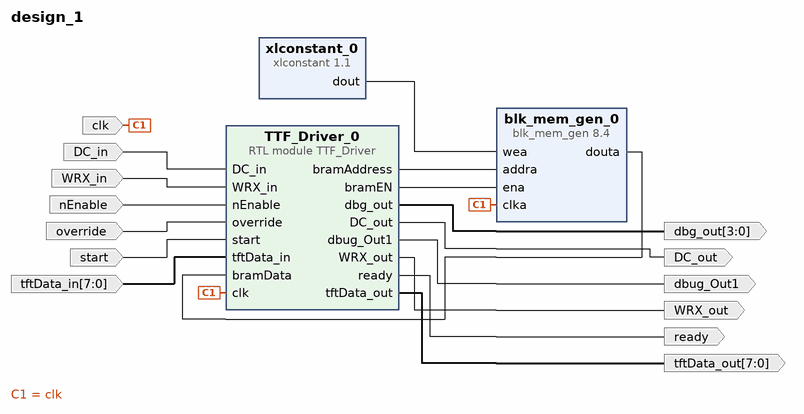
[diagram p0: block diagram of the top level]
# Vivado block design design_1, xc7a35tcpg236-1, Vivado 2023.2
create_bd_design design_1

create_bd_port -dir O DC_out
create_bd_port -dir O dbug_Out1
create_bd_port -dir I start
create_bd_port -dir O ready
create_bd_port -dir I nEnable
create_bd_port -dir I -type clk clk
create_bd_port -dir O -from 7 -to 0 tftData_out
create_bd_port -dir I WRX_in
create_bd_port -dir I DC_in
create_bd_port -dir I override
create_bd_port -dir O -from 3 -to 0 dbg_out
create_bd_port -dir O WRX_out
create_bd_port -dir I -from 7 -to 0 tftData_in

create_bd_cell -type ip -vlnv xilinx.com:ip:blk_mem_gen:8.4 blk_mem_gen_0
set_property -dict [list \
  CONFIG.Coe_File ../../../../../../../MemoryMap8Pix.coe \
  CONFIG.Enable_32bit_Address true \
  CONFIG.Load_Init_File true \
  CONFIG.Memory_Type Single_Port_RAM \
  CONFIG.Register_PortA_Output_of_Memory_Primitives true \
  CONFIG.Use_RSTA_Pin false \
  CONFIG.use_bram_block Stand_Alone \
] [get_bd_cells blk_mem_gen_0]
create_bd_cell -type ip -vlnv xilinx.com:ip:xlconstant:1.1 xlconstant_0
set_property -dict {CONFIG.CONST_VAL 0 CONFIG.CONST_WIDTH 4} [get_bd_cells xlconstant_0]
create_bd_cell -type module -reference TTF_Driver TTF_Driver_0

# ---- connections ----

connect_bd_net -net DC_in_0_1 [get_bd_ports DC_in] [get_bd_pins TTF_Driver_0/DC_in]
connect_bd_net [get_bd_pins TTF_Driver_0/DC_out] [get_bd_ports DC_out]
connect_bd_net [get_bd_pins TTF_Driver_0/WRX_out] [get_bd_ports WRX_out]
connect_bd_net [get_bd_pins TTF_Driver_0/bramAddress] [get_bd_pins blk_mem_gen_0/addra]
connect_bd_net [get_bd_pins TTF_Driver_0/bramEN] [get_bd_pins blk_mem_gen_0/ena]
connect_bd_net [get_bd_pins TTF_Driver_0/dbg_out] [get_bd_ports dbg_out]
connect_bd_net [get_bd_pins TTF_Driver_0/dbug_Out1] [get_bd_ports dbug_Out1]
connect_bd_net [get_bd_pins TTF_Driver_0/ready] [get_bd_ports ready]
connect_bd_net [get_bd_pins TTF_Driver_0/tftData_out] [get_bd_ports tftData_out]
connect_bd_net -net WRX_in_0_1 [get_bd_ports WRX_in] [get_bd_pins TTF_Driver_0/WRX_in]
connect_bd_net [get_bd_pins blk_mem_gen_0/douta] [get_bd_pins TTF_Driver_0/bramData]
connect_bd_net -net clk_0_1 [get_bd_ports clk] [get_bd_pins blk_mem_gen_0/clka] [get_bd_pins TTF_Driver_0/clk]
connect_bd_net -net nEnable_0_1 [get_bd_ports nEnable] [get_bd_pins TTF_Driver_0/nEnable]
connect_bd_net -net override_0_1 [get_bd_ports override] [get_bd_pins TTF_Driver_0/override]
connect_bd_net -net start_0_1 [get_bd_ports start] [get_bd_pins TTF_Driver_0/start]
connect_bd_net -net tftData_in_0_1 [get_bd_ports tftData_in] [get_bd_pins TTF_Driver_0/tftData_in]
connect_bd_net [get_bd_pins xlconstant_0/dout] [get_bd_pins blk_mem_gen_0/wea]

validate_bd_design
save_bd_design
